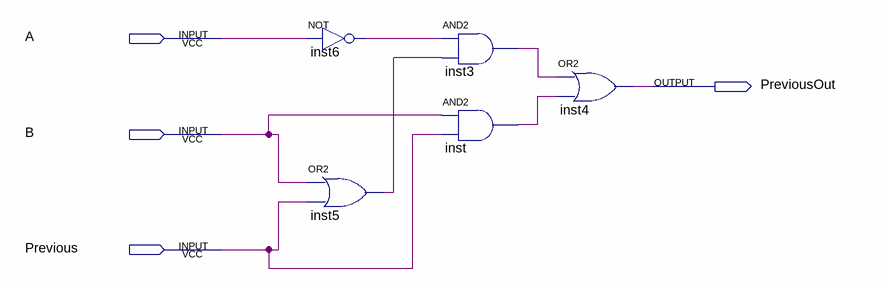
[diagram p0: schematic sheet]
// Quartus schematic MaiorQSignificativo.bdf as structural Verilog: 5 symbols, 4 pins
module MaiorQSignificativo (
  input  A,
  input  B,
  input  Previous,
  output PreviousOut
);

  wire inst3_out, inst5_out, inst6_out, inst_out;

  not inst6 (inst6_out, A);
  or inst5 (inst5_out, B, Previous);
  and inst3 (inst3_out, inst6_out, inst5_out);
  and inst (inst_out, B, Previous);
  or inst4 (PreviousOut, inst3_out, inst_out);
endmodule
